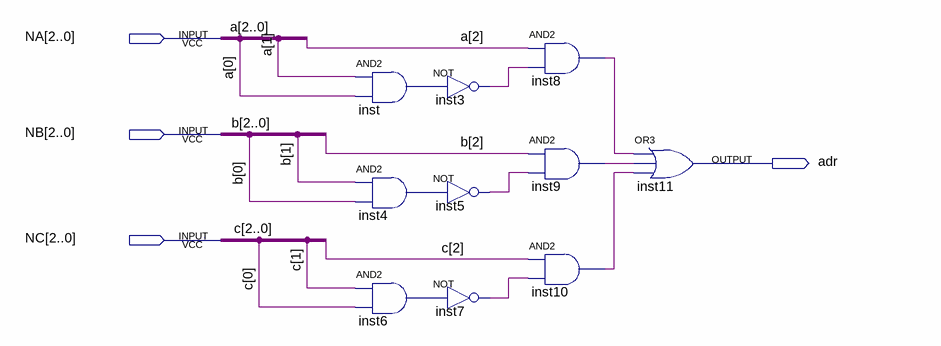
[diagram p0: schematic sheet]
// Quartus schematic TRUE_ALU_SELECT.bdf as structural Verilog: 10 symbols, 4 pins
module TRUE_ALU_SELECT (
  input  [2:0] NA,
  input  [2:0] NB,
  input  [2:0] NC,
  output adr
);

  wire inst3_out, inst4_out, inst5_out, inst6_out, inst7_out, inst8_out, inst9_out, inst10_out, inst_out;

  and inst (inst_out, NA[1], NA[0]);
  and inst4 (inst4_out, NB[1], NB[0]);
  and inst6 (inst6_out, NC[1], NC[0]);
  not inst3 (inst3_out, inst_out);
  not inst5 (inst5_out, inst4_out);
  not inst7 (inst7_out, inst6_out);
  and inst8 (inst8_out, NA[2], inst3_out);
  and inst9 (inst9_out, NB[2], inst5_out);
  and inst10 (inst10_out, NC[2], inst7_out);
  or inst11 (adr, inst8_out, inst9_out, inst10_out);

  // Other names for the same wires on the sheet: b[2:0] = NB; c[2:0] = NC; a[2:0] = NA
endmodule
